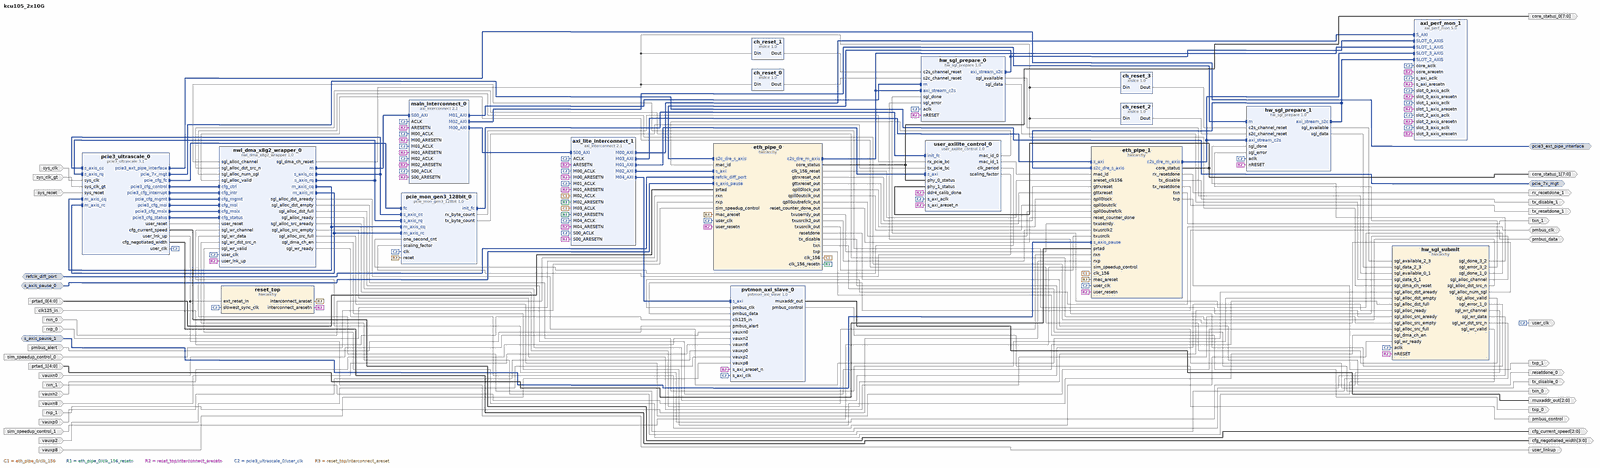
[diagram p0: block diagram of the top level, whole]
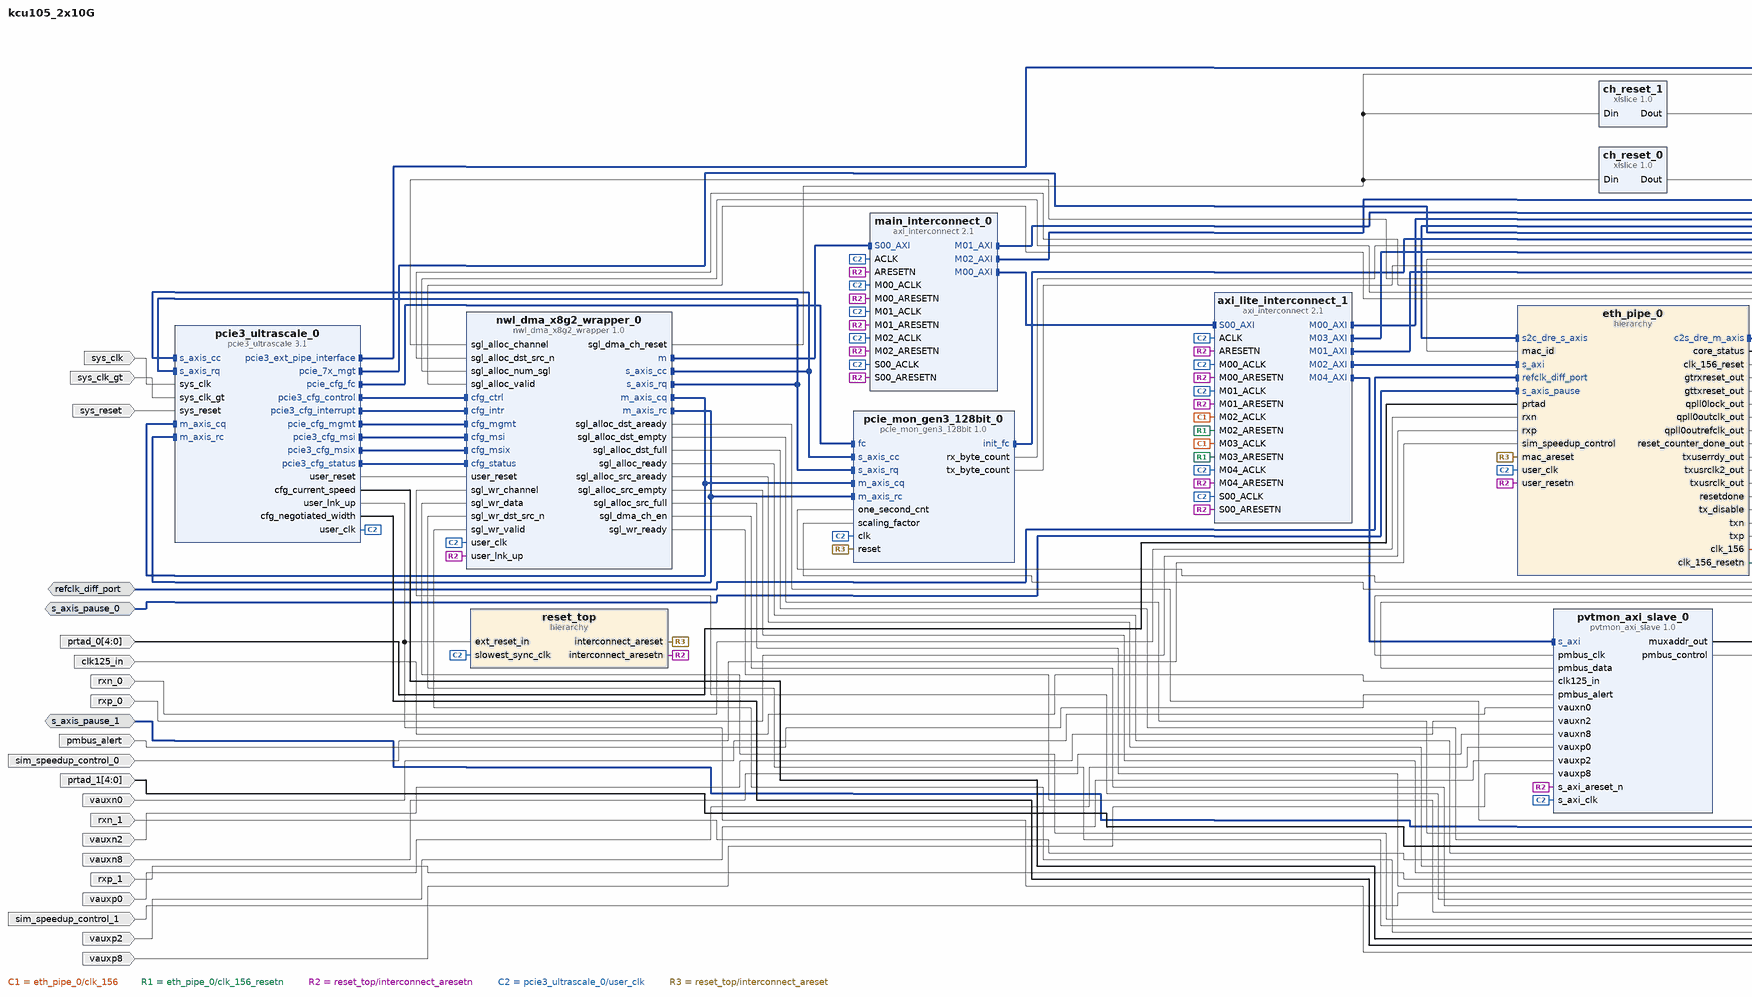
[diagram p1: block diagram of the top level, left part]
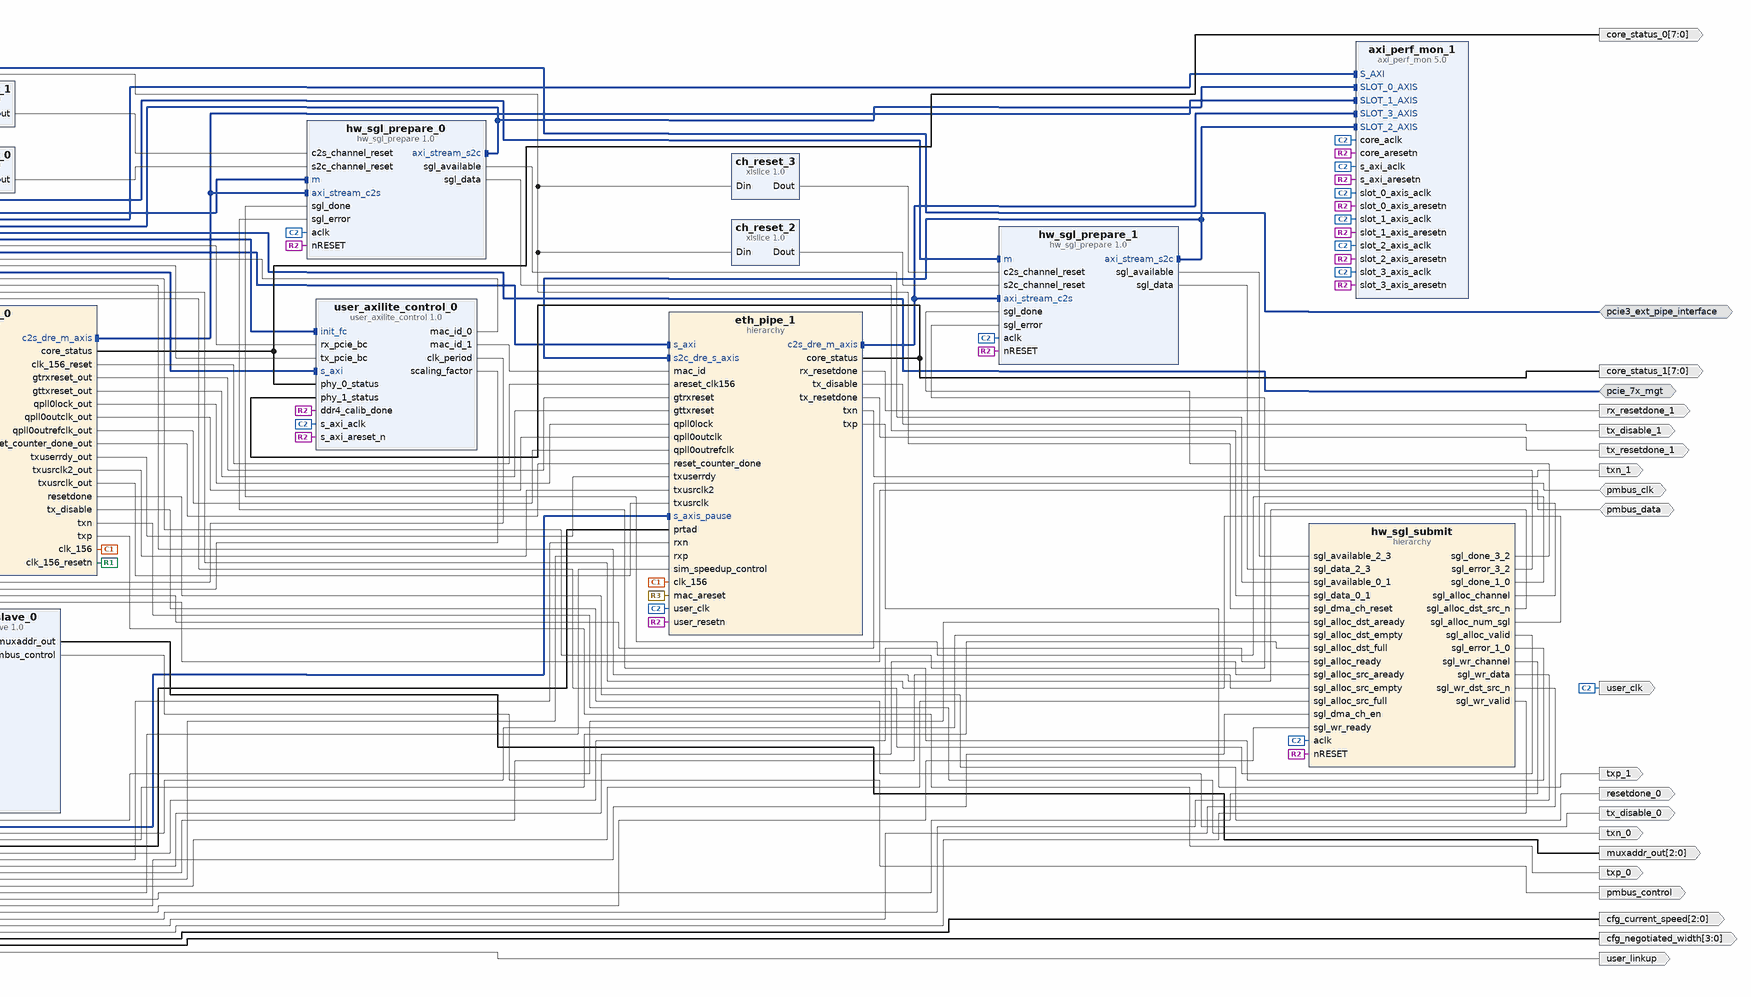
[diagram p2: block diagram of the top level, right part]
# Vivado block design kcu105_2x10G, Vivado 2014.3
create_bd_design kcu105_2x10G

create_bd_intf_port -mode Master -vlnv xilinx.com:display_pcie3_ultrascale:ext_pipe_rtl:1.0 pcie3_ext_pipe_interface
create_bd_intf_port -mode Master -vlnv xilinx.com:interface:pcie_7x_mgt_rtl:1.0 pcie_7x_mgt
create_bd_intf_port -mode Slave -vlnv xilinx.com:interface:diff_clock_rtl:1.0 refclk_diff_port
set_property -dict {CONFIG.FREQ_HZ 156250000} [get_bd_intf_ports refclk_diff_port]
create_bd_intf_port -mode Slave -vlnv xilinx.com:interface:axis_rtl:1.0 s_axis_pause_0
set_property -dict [list \
  CONFIG.TDATA_NUM_BYTES 2 \
  CONFIG.TDEST_WIDTH 0 \
  CONFIG.TID_WIDTH 0 \
  CONFIG.TUSER_WIDTH 0 \
  CONFIG.HAS_TREADY 0 \
  CONFIG.HAS_TSTRB 0 \
  CONFIG.HAS_TKEEP 0 \
  CONFIG.HAS_TLAST 0 \
  CONFIG.FREQ_HZ 156250000 \
  CONFIG.PHASE 0.000 \
  CONFIG.LAYERED_METADATA undef \
] [get_bd_intf_ports s_axis_pause_0]
create_bd_intf_port -mode Slave -vlnv xilinx.com:interface:axis_rtl:1.0 s_axis_pause_1
set_property -dict [list \
  CONFIG.TDATA_NUM_BYTES 2 \
  CONFIG.TDEST_WIDTH 0 \
  CONFIG.TID_WIDTH 0 \
  CONFIG.TUSER_WIDTH 0 \
  CONFIG.HAS_TREADY 0 \
  CONFIG.HAS_TSTRB 0 \
  CONFIG.HAS_TKEEP 0 \
  CONFIG.HAS_TLAST 0 \
  CONFIG.FREQ_HZ 156250000 \
  CONFIG.PHASE 0.000 \
  CONFIG.LAYERED_METADATA undef \
] [get_bd_intf_ports s_axis_pause_1]
create_bd_port -dir IO pmbus_clk
create_bd_port -dir IO pmbus_data
create_bd_port -dir I clk125_in
create_bd_port -dir O -from 7 -to 0 core_status_0
create_bd_port -dir O resetdone_0
create_bd_port -dir O tx_disable_0
create_bd_port -dir O txn_0
create_bd_port -dir O txp_0
create_bd_port -dir O -from 7 -to 0 core_status_1
create_bd_port -dir O rx_resetdone_1
create_bd_port -dir O tx_disable_1
create_bd_port -dir O tx_resetdone_1
create_bd_port -dir O txn_1
create_bd_port -dir O txp_1
create_bd_port -dir O -from 2 -to 0 cfg_current_speed
create_bd_port -dir O -from 3 -to 0 cfg_negotiated_width
create_bd_port -dir O user_clk
create_bd_port -dir I pmbus_alert
create_bd_port -dir I -from 4 -to 0 prtad_0
create_bd_port -dir I -from 4 -to 0 prtad_1
create_bd_port -dir O -from 2 -to 0 muxaddr_out
create_bd_port -dir O pmbus_control
create_bd_port -dir I rxn_0
create_bd_port -dir I rxn_1
create_bd_port -dir I rxp_0
create_bd_port -dir I rxp_1
create_bd_port -dir I sim_speedup_control_0
create_bd_port -dir I sim_speedup_control_1
create_bd_port -dir I -type clk sys_clk
create_bd_port -dir I -type clk sys_clk_gt
create_bd_port -dir I -type rst sys_reset
set_property -dict {CONFIG.POLARITY ACTIVE_LOW} [get_bd_ports sys_reset]
create_bd_port -dir O user_linkup
create_bd_port -dir I vauxn0
create_bd_port -dir I vauxn2
create_bd_port -dir I vauxn8
create_bd_port -dir I vauxp0
create_bd_port -dir I vauxp2
create_bd_port -dir I vauxp8

create_bd_cell -type ip -vlnv xilinx.com:ip:axi_interconnect:2.1 axi_lite_interconnect_1
set_property -dict [list \
  CONFIG.NUM_MI 5 \
  CONFIG.M00_HAS_REGSLICE 1 \
  CONFIG.M01_HAS_REGSLICE 1 \
  CONFIG.M02_HAS_REGSLICE 1 \
  CONFIG.M03_HAS_REGSLICE 1 \
  CONFIG.M04_HAS_REGSLICE 1 \
  CONFIG.S00_HAS_REGSLICE 3 \
] [get_bd_cells axi_lite_interconnect_1]
create_bd_cell -type ip -vlnv xilinx.com:ip:axi_perf_mon:5.0 axi_perf_mon_1
set_property -dict [list \
  CONFIG.C_SLOT_3_AXI_PROTOCOL AXI4S \
  CONFIG.C_SLOT_2_AXI_PROTOCOL AXI4S \
  CONFIG.C_SLOT_1_AXI_PROTOCOL AXI4S \
  CONFIG.C_SLOT_0_AXI_PROTOCOL AXI4S \
  CONFIG.C_NUM_OF_COUNTERS 4 \
  CONFIG.C_NUM_MONITOR_SLOTS 4 \
] [get_bd_cells axi_perf_mon_1]
create_bd_cell -type ip -vlnv xilinx.com:ip:xlslice:1.0 ch_reset_0
set_property -dict {CONFIG.DIN_WIDTH 4} [get_bd_cells ch_reset_0]
create_bd_cell -type ip -vlnv xilinx.com:ip:xlslice:1.0 ch_reset_1
set_property -dict {CONFIG.DIN_TO 1 CONFIG.DIN_FROM 1 CONFIG.DIN_WIDTH 4} [get_bd_cells ch_reset_1]
create_bd_cell -type ip -vlnv xilinx.com:ip:xlslice:1.0 ch_reset_2
set_property -dict {CONFIG.DIN_TO 2 CONFIG.DIN_FROM 2 CONFIG.DIN_WIDTH 4} [get_bd_cells ch_reset_2]
create_bd_cell -type ip -vlnv xilinx.com:ip:xlslice:1.0 ch_reset_3
set_property -dict {CONFIG.DIN_TO 3 CONFIG.DIN_FROM 3 CONFIG.DIN_WIDTH 4} [get_bd_cells ch_reset_3]
create_bd_cell -type hier eth_pipe_0
create_bd_cell -type hier eth_pipe_1
create_bd_cell -type hier hw_sgl_submit
create_bd_cell -type ip -vlnv xilinx.com:ip:axi_interconnect:2.1 main_interconnect_0
set_property -dict [list \
  CONFIG.NUM_MI 3 \
  CONFIG.STRATEGY 2 \
  CONFIG.ENABLE_ADVANCED_OPTIONS 1 \
  CONFIG.ENABLE_PROTOCOL_CHECKERS 0 \
  CONFIG.M00_HAS_REGSLICE 1 \
  CONFIG.M01_HAS_DATA_FIFO 1 \
  CONFIG.M02_HAS_DATA_FIFO 1 \
  CONFIG.S00_HAS_REGSLICE 3 \
] [get_bd_cells main_interconnect_0]
create_bd_cell -type ip -vlnv xilinx.com:user:nwl_dma_x8g2_wrapper:1.0 nwl_dma_x8g2_wrapper_0
create_bd_cell -type ip -vlnv xilinx.com:ip:pcie3_ultrascale:3.1 pcie3_ultrascale_0
set_property -dict [list \
  CONFIG.PL_LINK_CAP_MAX_LINK_SPEED 5.0_GT/s \
  CONFIG.PL_LINK_CAP_MAX_LINK_WIDTH X8 \
  CONFIG.PF0_DEVICE_ID 8082 \
  CONFIG.PF0_MSIX_CAP_PBA_BIR BAR_1:0 \
  CONFIG.PF0_MSIX_CAP_PBA_OFFSET 00003000 \
  CONFIG.PF0_MSIX_CAP_TABLE_BIR BAR_1:0 \
  CONFIG.PF0_MSIX_CAP_TABLE_OFFSET 00002000 \
  CONFIG.PF0_MSIX_CAP_TABLE_SIZE 003 \
  CONFIG.PF1_DEVICE_ID 8011 \
  CONFIG.pf0_bar0_64bit true \
  CONFIG.pf0_bar0_scale Megabytes \
  CONFIG.pf0_bar0_size 1 \
  CONFIG.pf0_bar2_enabled true \
  CONFIG.pf0_bar2_type Memory \
  CONFIG.pf0_bar2_64bit true \
  CONFIG.pf0_bar2_scale Megabytes \
  CONFIG.pf0_bar2_size 1 \
  CONFIG.pf0_bar4_enabled true \
  CONFIG.pf0_bar4_type Memory \
  CONFIG.pf0_bar4_64bit true \
  CONFIG.pf0_bar4_scale Megabytes \
  CONFIG.pf0_bar4_size 1 \
  CONFIG.axisten_if_width 128_bit \
  CONFIG.pf0_msix_enabled true \
  CONFIG.mode_selection Advanced \
  CONFIG.pipe_sim true \
  CONFIG.axisten_freq 250 \
  CONFIG.cfg_ext_if false \
  CONFIG.per_func_status_if false \
  CONFIG.rcv_msg_if false \
  CONFIG.cfg_tx_msg_if false \
  CONFIG.tx_fc_if false \
  CONFIG.dedicate_perst false \
] [get_bd_cells pcie3_ultrascale_0]
create_bd_cell -type ip -vlnv xilinx.com:ip:pcie_mon_gen3_128bit:1.0 pcie_mon_gen3_128bit_0
create_bd_cell -type ip -vlnv xilinx.com:user:pvtmon_axi_slave:1.0 pvtmon_axi_slave_0
create_bd_cell -type hier reset_top
create_bd_cell -type ip -vlnv xilinx.com:user:user_axilite_control:1.0 user_axilite_control_0
create_bd_cell -type ip -vlnv xilinx.com:ip:hw_sgl_prepare:1.0 hw_sgl_prepare_0
set_property -dict {CONFIG.START_ADDRESS 0x44000000} [get_bd_cells hw_sgl_prepare_0]
create_bd_cell -type ip -vlnv xilinx.com:ip:hw_sgl_prepare:1.0 hw_sgl_prepare_1
set_property -dict {CONFIG.START_ADDRESS 0x45000000} [get_bd_cells hw_sgl_prepare_1]

# ---- hierarchy /eth_pipe_0 ----
current_bd_instance /eth_pipe_0
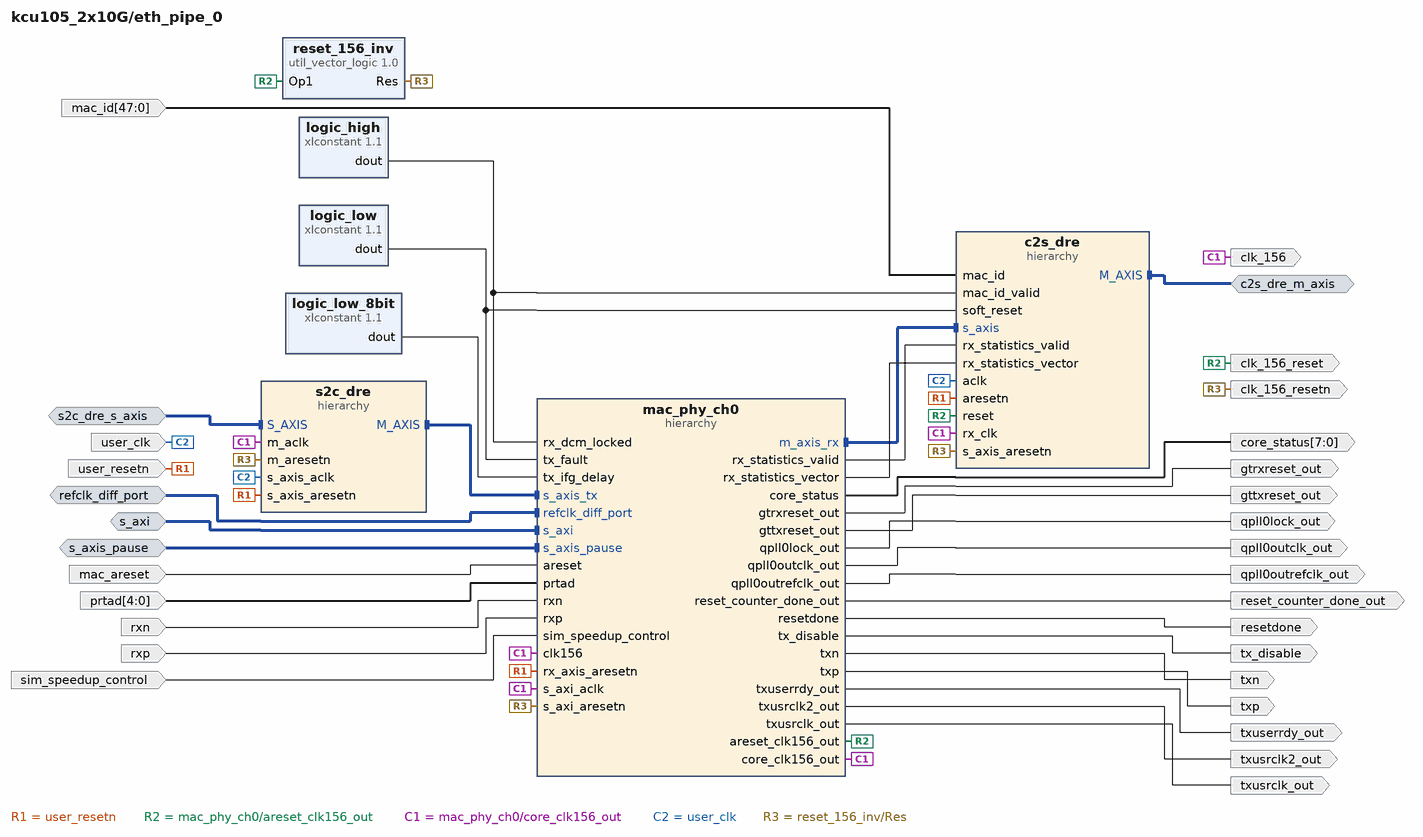
[diagram p3: block diagram inside /eth_pipe_0]
create_bd_intf_pin -mode Master -vlnv xilinx.com:interface:axis_rtl:1.0 c2s_dre_m_axis
create_bd_intf_pin -mode Slave -vlnv xilinx.com:interface:diff_clock_rtl:1.0 refclk_diff_port
create_bd_intf_pin -mode Slave -vlnv xilinx.com:interface:axis_rtl:1.0 s2c_dre_s_axis
create_bd_intf_pin -mode Slave -vlnv xilinx.com:interface:aximm_rtl:1.0 s_axi
create_bd_intf_pin -mode Slave -vlnv xilinx.com:interface:axis_rtl:1.0 s_axis_pause
create_bd_pin -dir O clk_156
create_bd_pin -dir O clk_156_reset
create_bd_pin -dir O clk_156_resetn
create_bd_pin -dir O -from 7 -to 0 core_status
create_bd_pin -dir O gtrxreset_out
create_bd_pin -dir O gttxreset_out
create_bd_pin -dir I mac_areset
create_bd_pin -dir I -from 47 -to 0 mac_id
create_bd_pin -dir I -from 4 -to 0 prtad
create_bd_pin -dir O qpll0lock_out
create_bd_pin -dir O qpll0outclk_out
create_bd_pin -dir O qpll0outrefclk_out
create_bd_pin -dir O reset_counter_done_out
create_bd_pin -dir O resetdone
create_bd_pin -dir I rxn
create_bd_pin -dir I rxp
create_bd_pin -dir I sim_speedup_control
create_bd_pin -dir O tx_disable
create_bd_pin -dir O txn
create_bd_pin -dir O txp
create_bd_pin -dir O txuserrdy_out
create_bd_pin -dir O txusrclk2_out
create_bd_pin -dir O txusrclk_out
create_bd_pin -dir I user_clk
create_bd_pin -dir I user_resetn

create_bd_cell -type hier c2s_dre
create_bd_cell -type ip -vlnv xilinx.com:ip:xlconstant:1.1 logic_high
create_bd_cell -type ip -vlnv xilinx.com:ip:xlconstant:1.1 logic_low
create_bd_cell -type ip -vlnv xilinx.com:ip:xlconstant:1.1 logic_low_8bit
set_property -dict {CONFIG.CONST_WIDTH 8 CONFIG.CONST_VAL 0} [get_bd_cells logic_low_8bit]
create_bd_cell -type hier mac_phy_ch0
create_bd_cell -type ip -vlnv xilinx.com:ip:util_vector_logic:1.0 reset_156_inv
set_property -dict {CONFIG.C_SIZE 1 CONFIG.C_OPERATION not} [get_bd_cells reset_156_inv]
create_bd_cell -type hier s2c_dre

# ---- hierarchy /eth_pipe_0/c2s_dre ----
current_bd_instance /eth_pipe_0/c2s_dre
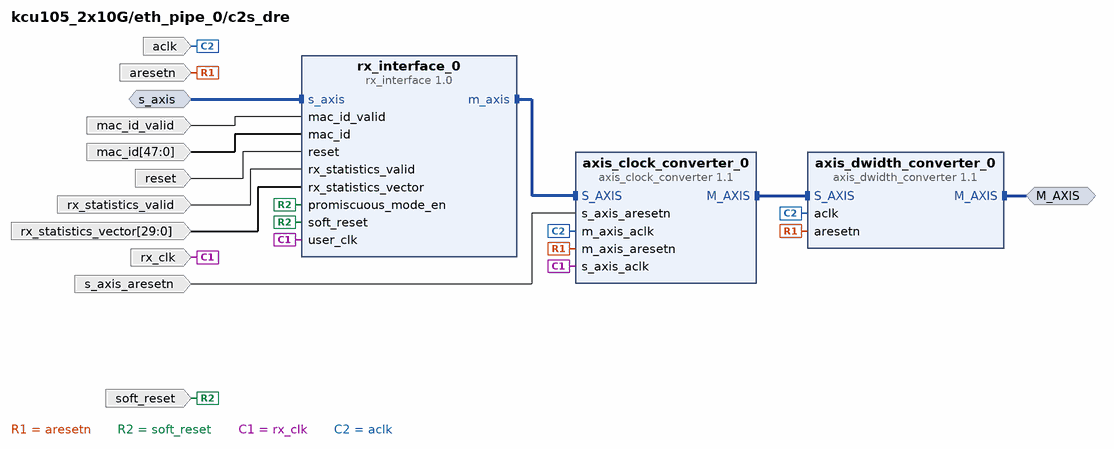
[diagram p4: block diagram inside /eth_pipe_0/c2s_dre]
create_bd_intf_pin -mode Master -vlnv xilinx.com:interface:axis_rtl:1.0 M_AXIS
create_bd_intf_pin -mode Slave -vlnv xilinx.com:interface:axis_rtl:1.0 s_axis
create_bd_pin -dir I -type clk aclk
create_bd_pin -dir I -type rst aresetn
create_bd_pin -dir I -from 47 -to 0 mac_id
create_bd_pin -dir I mac_id_valid
create_bd_pin -dir I reset
create_bd_pin -dir I -type clk rx_clk
create_bd_pin -dir I rx_statistics_valid
create_bd_pin -dir I -from 29 -to 0 rx_statistics_vector
create_bd_pin -dir I -type rst s_axis_aresetn
create_bd_pin -dir I soft_reset

create_bd_cell -type ip -vlnv xilinx.com:ip:axis_clock_converter:1.1 axis_clock_converter_0
set_property -dict [list \
  CONFIG.TDATA_NUM_BYTES 8 \
  CONFIG.TDEST_WIDTH 2 \
  CONFIG.HAS_TKEEP 1 \
  CONFIG.HAS_TLAST 1 \
] [get_bd_cells axis_clock_converter_0]
create_bd_cell -type ip -vlnv xilinx.com:ip:axis_dwidth_converter:1.1 axis_dwidth_converter_0
set_property -dict {CONFIG.M_TDATA_NUM_BYTES 16} [get_bd_cells axis_dwidth_converter_0]
create_bd_cell -type ip -vlnv xilinx.com:user:rx_interface:1.0 rx_interface_0
set_property -dict {CONFIG.FIFO_CNT_WIDTH 13} [get_bd_cells rx_interface_0]

# ---- hierarchy /eth_pipe_0/mac_phy_ch0 ----
current_bd_instance /eth_pipe_0/mac_phy_ch0
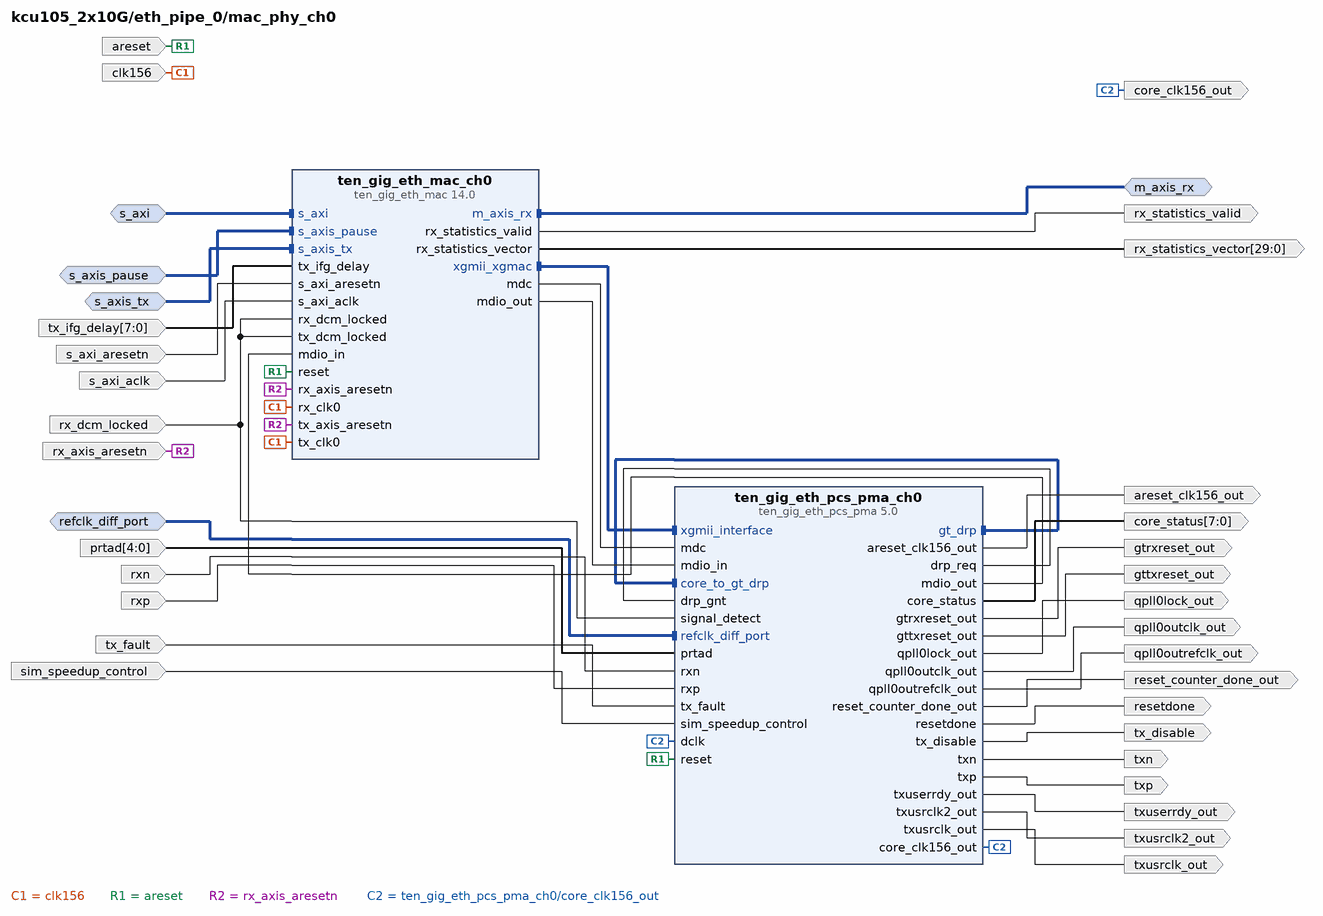
[diagram p5: block diagram inside /eth_pipe_0/mac_phy_ch0]
create_bd_intf_pin -mode Master -vlnv xilinx.com:interface:axis_rtl:1.0 m_axis_rx
create_bd_intf_pin -mode Slave -vlnv xilinx.com:interface:diff_clock_rtl:1.0 refclk_diff_port
create_bd_intf_pin -mode Slave -vlnv xilinx.com:interface:aximm_rtl:1.0 s_axi
create_bd_intf_pin -mode Slave -vlnv xilinx.com:interface:axis_rtl:1.0 s_axis_pause
create_bd_intf_pin -mode Slave -vlnv xilinx.com:interface:axis_rtl:1.0 s_axis_tx
create_bd_pin -dir I areset
create_bd_pin -dir O -type rst areset_clk156_out
create_bd_pin -dir I -type clk clk156
create_bd_pin -dir O -type clk core_clk156_out
create_bd_pin -dir O -from 7 -to 0 core_status
create_bd_pin -dir O -type rst gtrxreset_out
create_bd_pin -dir O -type rst gttxreset_out
create_bd_pin -dir I -from 4 -to 0 prtad
create_bd_pin -dir O qpll0lock_out
create_bd_pin -dir O -type clk qpll0outclk_out
create_bd_pin -dir O -type clk qpll0outrefclk_out
create_bd_pin -dir O reset_counter_done_out
create_bd_pin -dir O resetdone
create_bd_pin -dir I -type rst rx_axis_aresetn
create_bd_pin -dir I rx_dcm_locked
create_bd_pin -dir O rx_statistics_valid
create_bd_pin -dir O -from 29 -to 0 rx_statistics_vector
create_bd_pin -dir I rxn
create_bd_pin -dir I rxp
create_bd_pin -dir I s_axi_aclk
create_bd_pin -dir I s_axi_aresetn
create_bd_pin -dir I sim_speedup_control
create_bd_pin -dir O tx_disable
create_bd_pin -dir I tx_fault
create_bd_pin -dir I -from 7 -to 0 tx_ifg_delay
create_bd_pin -dir O txn
create_bd_pin -dir O txp
create_bd_pin -dir O txuserrdy_out
create_bd_pin -dir O -type clk txusrclk2_out
create_bd_pin -dir O -type clk txusrclk_out

create_bd_cell -type ip -vlnv xilinx.com:ip:ten_gig_eth_mac:14.0 ten_gig_eth_mac_ch0
create_bd_cell -type ip -vlnv xilinx.com:ip:ten_gig_eth_pcs_pma:5.0 ten_gig_eth_pcs_pma_ch0
set_property -dict {CONFIG.base_kr BASE-R CONFIG.SupportLevel 1 CONFIG.Locations X0Y10} [get_bd_cells ten_gig_eth_pcs_pma_ch0]

# ---- hierarchy /eth_pipe_0/s2c_dre ----
current_bd_instance /eth_pipe_0/s2c_dre
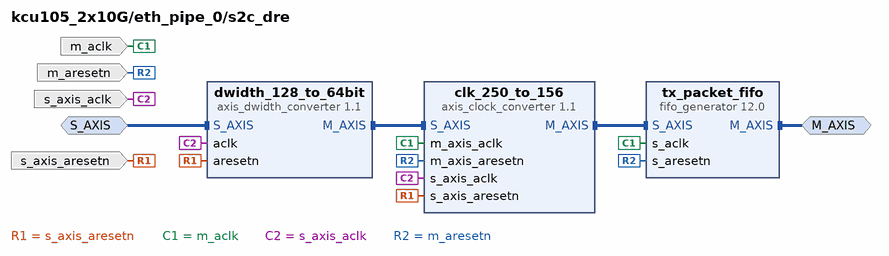
[diagram p6: block diagram inside /eth_pipe_0/s2c_dre]
create_bd_intf_pin -mode Master -vlnv xilinx.com:interface:axis_rtl:1.0 M_AXIS
create_bd_intf_pin -mode Slave -vlnv xilinx.com:interface:axis_rtl:1.0 S_AXIS
create_bd_pin -dir I -type clk m_aclk
create_bd_pin -dir I -type rst m_aresetn
create_bd_pin -dir I -type clk s_axis_aclk
create_bd_pin -dir I -type rst s_axis_aresetn

create_bd_cell -type ip -vlnv xilinx.com:ip:axis_clock_converter:1.1 clk_250_to_156
set_property -dict {CONFIG.TDATA_NUM_BYTES 8 CONFIG.HAS_TKEEP 1 CONFIG.HAS_TLAST 1} [get_bd_cells clk_250_to_156]
create_bd_cell -type ip -vlnv xilinx.com:ip:axis_dwidth_converter:1.1 dwidth_128_to_64bit
set_property -dict {CONFIG.M_TDATA_NUM_BYTES 8} [get_bd_cells dwidth_128_to_64bit]
create_bd_cell -type ip -vlnv xilinx.com:ip:fifo_generator:12.0 tx_packet_fifo
set_property -dict [list \
  CONFIG.INTERFACE_TYPE AXI_STREAM \
  CONFIG.Clock_Type_AXI Common_Clock \
  CONFIG.TDATA_NUM_BYTES 8 \
  CONFIG.TUSER_WIDTH 0 \
  CONFIG.Enable_TLAST true \
  CONFIG.HAS_TKEEP true \
  CONFIG.FIFO_Implementation_wach Common_Clock_Distributed_RAM \
  CONFIG.FIFO_Implementation_wdch Common_Clock_Builtin_FIFO \
  CONFIG.Input_Depth_wdch 512 \
  CONFIG.FIFO_Implementation_wrch Common_Clock_Distributed_RAM \
  CONFIG.FIFO_Implementation_rach Common_Clock_Distributed_RAM \
  CONFIG.FIFO_Implementation_rdch Common_Clock_Builtin_FIFO \
  CONFIG.Input_Depth_rdch 512 \
  CONFIG.FIFO_Implementation_axis Common_Clock_Block_RAM \
  CONFIG.FIFO_Application_Type_axis Packet_FIFO \
  CONFIG.Input_Depth_axis 2048 \
] [get_bd_cells tx_packet_fifo]

# ---- hierarchy /eth_pipe_1 ----
current_bd_instance /eth_pipe_1
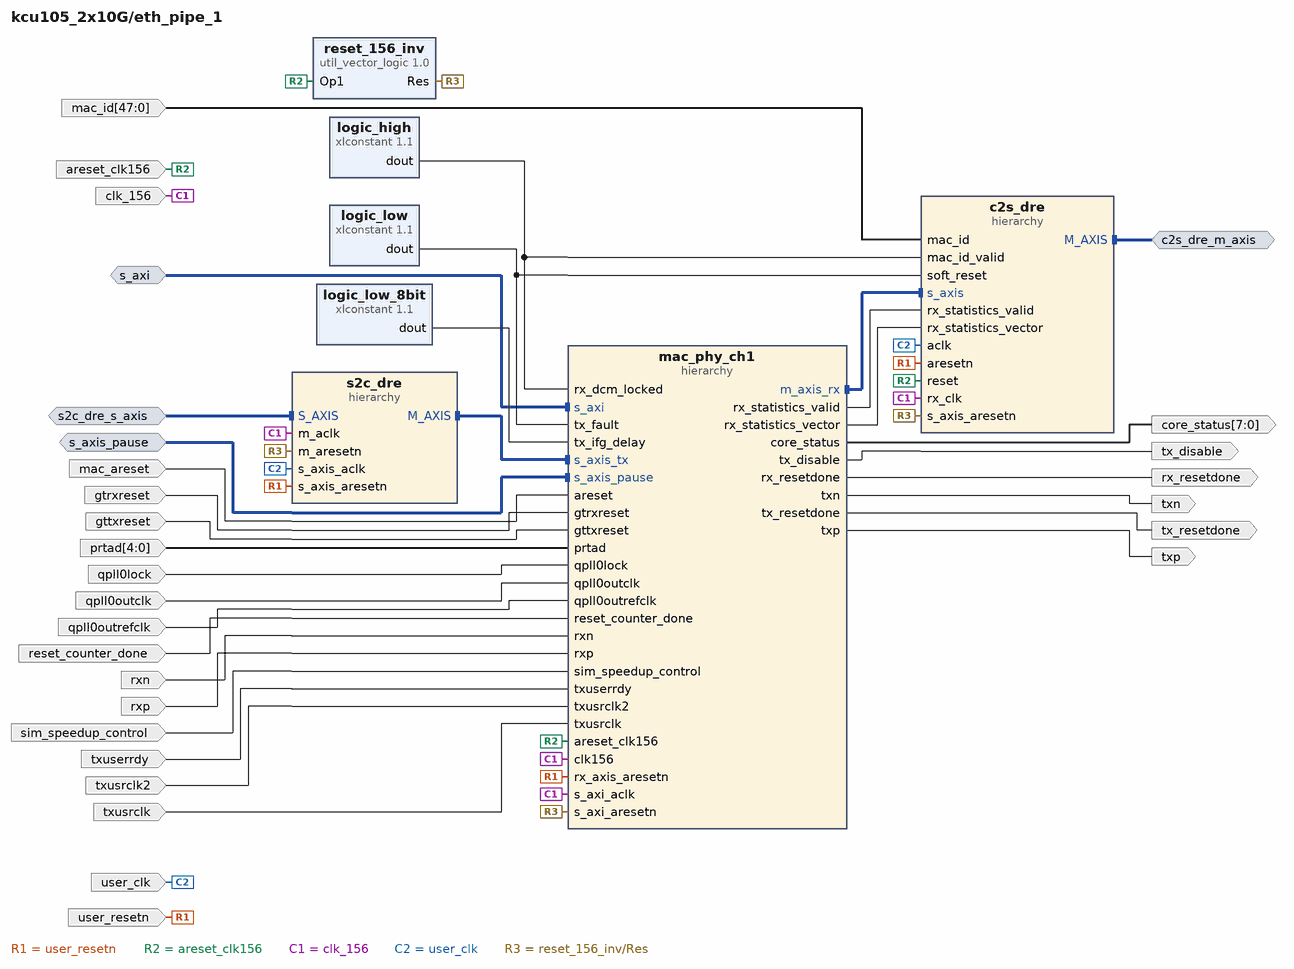
[diagram p7: block diagram inside /eth_pipe_1]
create_bd_intf_pin -mode Master -vlnv xilinx.com:interface:axis_rtl:1.0 c2s_dre_m_axis
create_bd_intf_pin -mode Slave -vlnv xilinx.com:interface:axis_rtl:1.0 s2c_dre_s_axis
create_bd_intf_pin -mode Slave -vlnv xilinx.com:interface:aximm_rtl:1.0 s_axi
create_bd_intf_pin -mode Slave -vlnv xilinx.com:interface:axis_rtl:1.0 s_axis_pause
create_bd_pin -dir I areset_clk156
create_bd_pin -dir I clk_156
create_bd_pin -dir O -from 7 -to 0 core_status
create_bd_pin -dir I gtrxreset
create_bd_pin -dir I gttxreset
create_bd_pin -dir I mac_areset
create_bd_pin -dir I -from 47 -to 0 mac_id
create_bd_pin -dir I -from 4 -to 0 prtad
create_bd_pin -dir I qpll0lock
create_bd_pin -dir I qpll0outclk
create_bd_pin -dir I qpll0outrefclk
create_bd_pin -dir I reset_counter_done
create_bd_pin -dir O rx_resetdone
create_bd_pin -dir I rxn
create_bd_pin -dir I rxp
create_bd_pin -dir I sim_speedup_control
create_bd_pin -dir O tx_disable
create_bd_pin -dir O tx_resetdone
create_bd_pin -dir O txn
create_bd_pin -dir O txp
create_bd_pin -dir I txuserrdy
create_bd_pin -dir I txusrclk
create_bd_pin -dir I txusrclk2
create_bd_pin -dir I user_clk
create_bd_pin -dir I user_resetn

create_bd_cell -type hier c2s_dre
create_bd_cell -type ip -vlnv xilinx.com:ip:xlconstant:1.1 logic_high
create_bd_cell -type ip -vlnv xilinx.com:ip:xlconstant:1.1 logic_low
create_bd_cell -type ip -vlnv xilinx.com:ip:xlconstant:1.1 logic_low_8bit
set_property -dict {CONFIG.CONST_WIDTH 8 CONFIG.CONST_VAL 0} [get_bd_cells logic_low_8bit]
create_bd_cell -type hier mac_phy_ch1
create_bd_cell -type ip -vlnv xilinx.com:ip:util_vector_logic:1.0 reset_156_inv
set_property -dict {CONFIG.C_SIZE 1 CONFIG.C_OPERATION not} [get_bd_cells reset_156_inv]
create_bd_cell -type hier s2c_dre

# ---- hierarchy /eth_pipe_1/c2s_dre ----
current_bd_instance /eth_pipe_1/c2s_dre
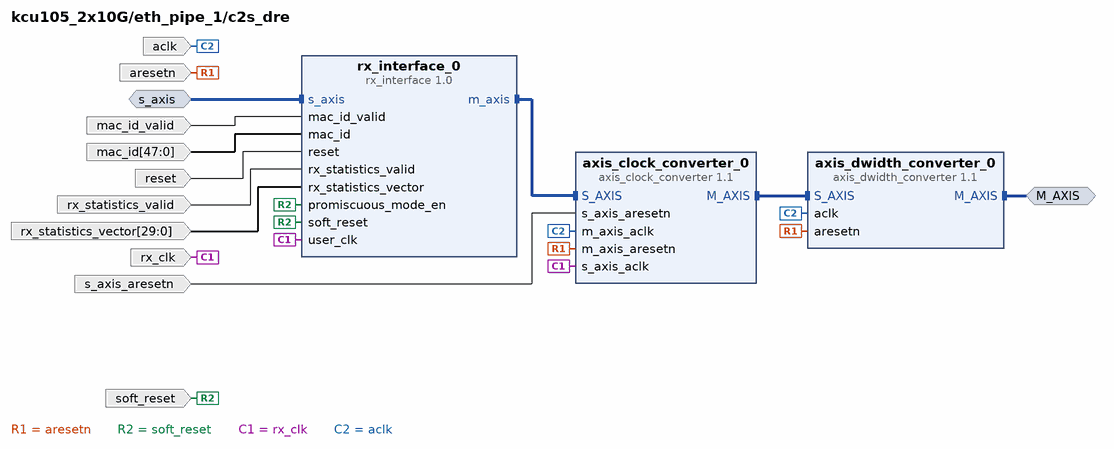
[diagram p8: block diagram inside /eth_pipe_1/c2s_dre]
create_bd_intf_pin -mode Master -vlnv xilinx.com:interface:axis_rtl:1.0 M_AXIS
create_bd_intf_pin -mode Slave -vlnv xilinx.com:interface:axis_rtl:1.0 s_axis
create_bd_pin -dir I -type clk aclk
create_bd_pin -dir I -type rst aresetn
create_bd_pin -dir I -from 47 -to 0 mac_id
create_bd_pin -dir I mac_id_valid
create_bd_pin -dir I reset
create_bd_pin -dir I -type clk rx_clk
create_bd_pin -dir I rx_statistics_valid
create_bd_pin -dir I -from 29 -to 0 rx_statistics_vector
create_bd_pin -dir I -type rst s_axis_aresetn
create_bd_pin -dir I soft_reset

create_bd_cell -type ip -vlnv xilinx.com:ip:axis_clock_converter:1.1 axis_clock_converter_0
set_property -dict [list \
  CONFIG.TDATA_NUM_BYTES 8 \
  CONFIG.TDEST_WIDTH 2 \
  CONFIG.HAS_TKEEP 1 \
  CONFIG.HAS_TLAST 1 \
] [get_bd_cells axis_clock_converter_0]
create_bd_cell -type ip -vlnv xilinx.com:ip:axis_dwidth_converter:1.1 axis_dwidth_converter_0
set_property -dict {CONFIG.M_TDATA_NUM_BYTES 16} [get_bd_cells axis_dwidth_converter_0]
create_bd_cell -type ip -vlnv xilinx.com:user:rx_interface:1.0 rx_interface_0
set_property -dict {CONFIG.FIFO_CNT_WIDTH 13} [get_bd_cells rx_interface_0]

# ---- hierarchy /eth_pipe_1/mac_phy_ch1 ----
current_bd_instance /eth_pipe_1/mac_phy_ch1
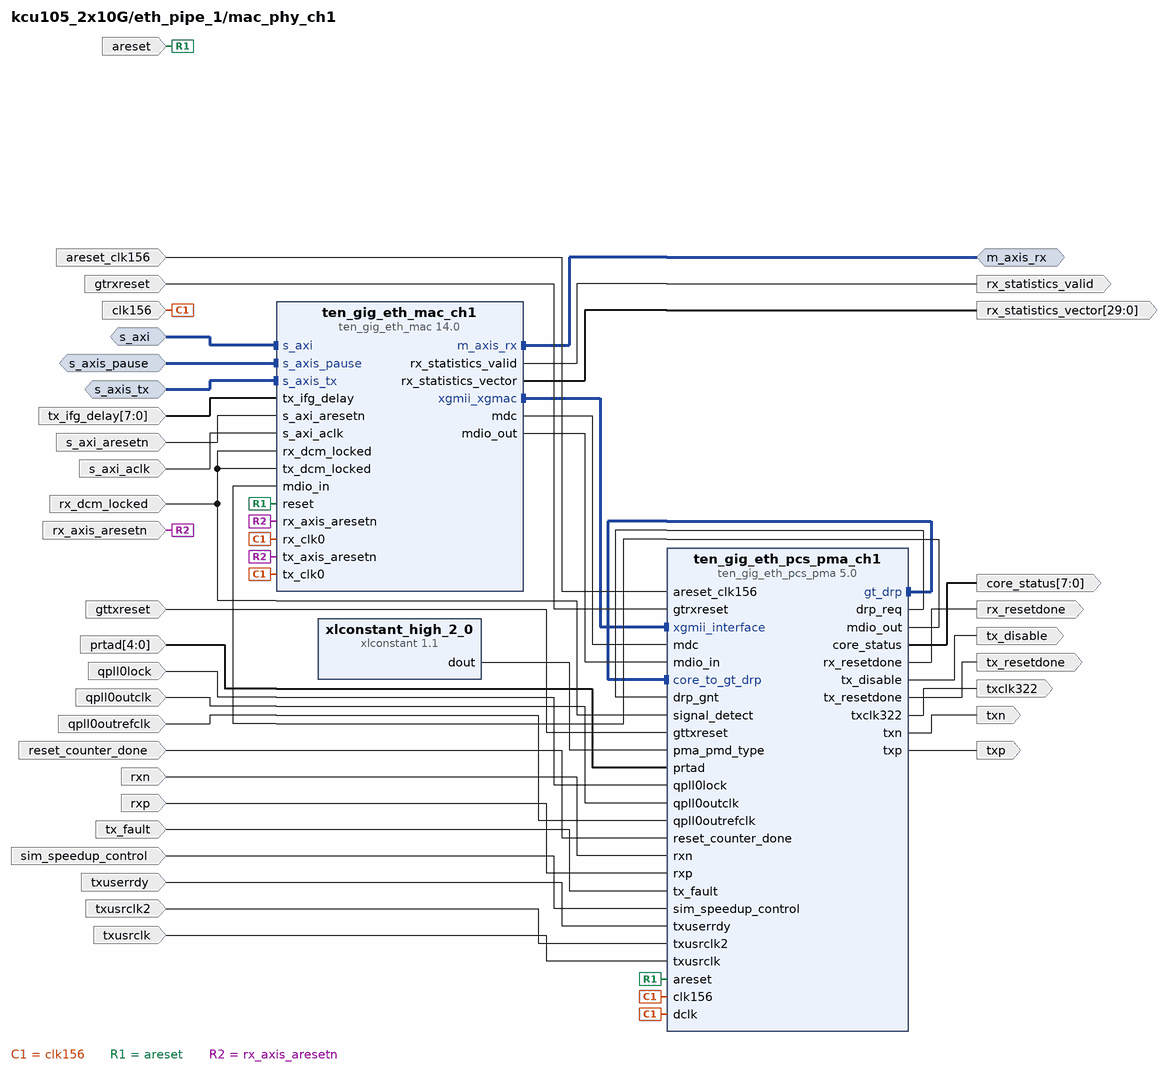
[diagram p9: block diagram inside /eth_pipe_1/mac_phy_ch1]
create_bd_intf_pin -mode Master -vlnv xilinx.com:interface:axis_rtl:1.0 m_axis_rx
create_bd_intf_pin -mode Slave -vlnv xilinx.com:interface:aximm_rtl:1.0 s_axi
create_bd_intf_pin -mode Slave -vlnv xilinx.com:interface:axis_rtl:1.0 s_axis_pause
create_bd_intf_pin -mode Slave -vlnv xilinx.com:interface:axis_rtl:1.0 s_axis_tx
create_bd_pin -dir I areset
create_bd_pin -dir I areset_clk156
create_bd_pin -dir I -type clk clk156
create_bd_pin -dir O -from 7 -to 0 core_status
create_bd_pin -dir I gtrxreset
create_bd_pin -dir I gttxreset
create_bd_pin -dir I -from 4 -to 0 prtad
create_bd_pin -dir I qpll0lock
create_bd_pin -dir I qpll0outclk
create_bd_pin -dir I qpll0outrefclk
create_bd_pin -dir I reset_counter_done
create_bd_pin -dir I -type rst rx_axis_aresetn
create_bd_pin -dir I rx_dcm_locked
create_bd_pin -dir O rx_resetdone
create_bd_pin -dir O rx_statistics_valid
create_bd_pin -dir O -from 29 -to 0 rx_statistics_vector
create_bd_pin -dir I rxn
create_bd_pin -dir I rxp
create_bd_pin -dir I s_axi_aclk
create_bd_pin -dir I s_axi_aresetn
create_bd_pin -dir I sim_speedup_control
create_bd_pin -dir O tx_disable
create_bd_pin -dir I tx_fault
create_bd_pin -dir I -from 7 -to 0 tx_ifg_delay
create_bd_pin -dir O tx_resetdone
create_bd_pin -dir O txclk322
create_bd_pin -dir O txn
create_bd_pin -dir O txp
create_bd_pin -dir I txuserrdy
create_bd_pin -dir I txusrclk
create_bd_pin -dir I txusrclk2

create_bd_cell -type ip -vlnv xilinx.com:ip:ten_gig_eth_mac:14.0 ten_gig_eth_mac_ch1
create_bd_cell -type ip -vlnv xilinx.com:ip:ten_gig_eth_pcs_pma:5.0 ten_gig_eth_pcs_pma_ch1
set_property -dict {CONFIG.base_kr BASE-R CONFIG.SupportLevel 0 CONFIG.Locations X0Y9} [get_bd_cells ten_gig_eth_pcs_pma_ch1]
create_bd_cell -type ip -vlnv xilinx.com:ip:xlconstant:1.1 xlconstant_high_2_0
set_property -dict {CONFIG.CONST_WIDTH 3 CONFIG.CONST_VAL 101} [get_bd_cells xlconstant_high_2_0]

# ---- hierarchy /eth_pipe_1/s2c_dre ----
current_bd_instance /eth_pipe_1/s2c_dre
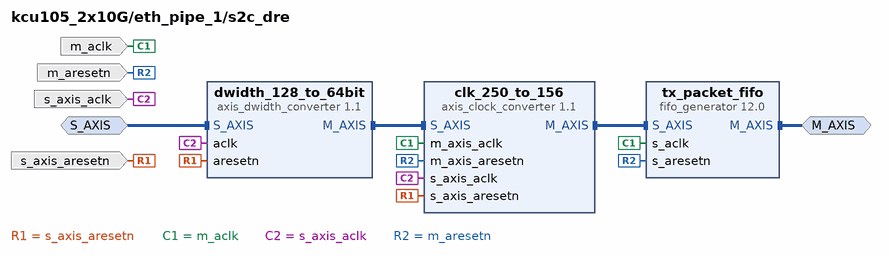
[diagram p10: block diagram inside /eth_pipe_1/s2c_dre]
create_bd_intf_pin -mode Master -vlnv xilinx.com:interface:axis_rtl:1.0 M_AXIS
create_bd_intf_pin -mode Slave -vlnv xilinx.com:interface:axis_rtl:1.0 S_AXIS
create_bd_pin -dir I -type clk m_aclk
create_bd_pin -dir I -type rst m_aresetn
create_bd_pin -dir I -type clk s_axis_aclk
create_bd_pin -dir I -type rst s_axis_aresetn

create_bd_cell -type ip -vlnv xilinx.com:ip:axis_clock_converter:1.1 clk_250_to_156
set_property -dict {CONFIG.TDATA_NUM_BYTES 8 CONFIG.HAS_TKEEP 1 CONFIG.HAS_TLAST 1} [get_bd_cells clk_250_to_156]
create_bd_cell -type ip -vlnv xilinx.com:ip:axis_dwidth_converter:1.1 dwidth_128_to_64bit
set_property -dict {CONFIG.M_TDATA_NUM_BYTES 8} [get_bd_cells dwidth_128_to_64bit]
create_bd_cell -type ip -vlnv xilinx.com:ip:fifo_generator:12.0 tx_packet_fifo
set_property -dict [list \
  CONFIG.INTERFACE_TYPE AXI_STREAM \
  CONFIG.Clock_Type_AXI Common_Clock \
  CONFIG.TDATA_NUM_BYTES 8 \
  CONFIG.TUSER_WIDTH 0 \
  CONFIG.Enable_TLAST true \
  CONFIG.HAS_TKEEP true \
  CONFIG.FIFO_Implementation_wach Common_Clock_Distributed_RAM \
  CONFIG.FIFO_Implementation_wdch Common_Clock_Builtin_FIFO \
  CONFIG.Input_Depth_wdch 512 \
  CONFIG.FIFO_Implementation_wrch Common_Clock_Distributed_RAM \
  CONFIG.FIFO_Implementation_rach Common_Clock_Distributed_RAM \
  CONFIG.FIFO_Implementation_rdch Common_Clock_Builtin_FIFO \
  CONFIG.Input_Depth_rdch 512 \
  CONFIG.FIFO_Implementation_axis Common_Clock_Block_RAM \
  CONFIG.FIFO_Application_Type_axis Packet_FIFO \
  CONFIG.Input_Depth_axis 2048 \
] [get_bd_cells tx_packet_fifo]

# ---- hierarchy /hw_sgl_submit ----
current_bd_instance /hw_sgl_submit
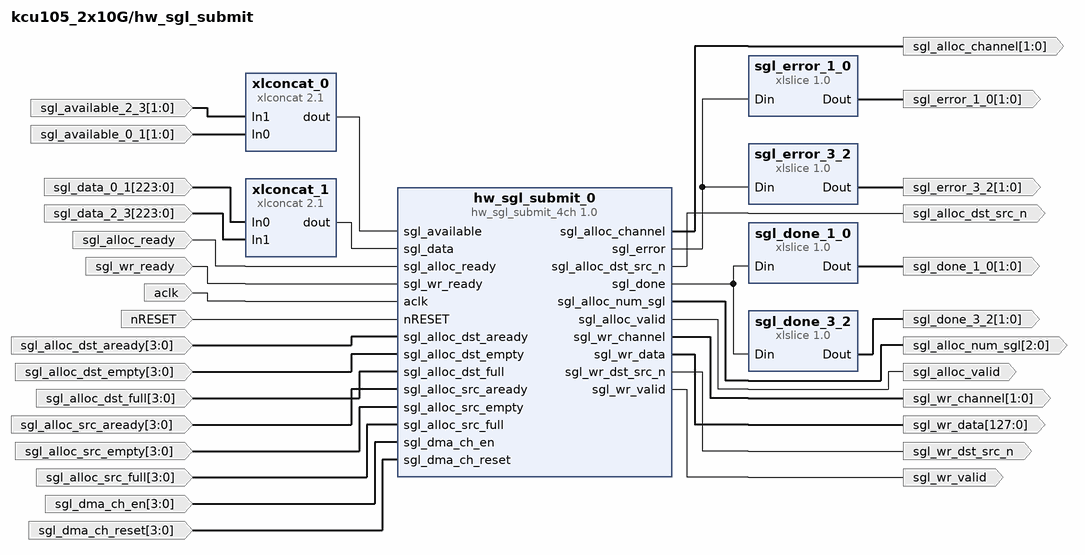
[diagram p11: block diagram inside /hw_sgl_submit]
create_bd_pin -dir I -type clk aclk
create_bd_pin -dir I -type rst nRESET
create_bd_pin -dir O -from 1 -to 0 sgl_alloc_channel
create_bd_pin -dir I -from 3 -to 0 sgl_alloc_dst_aready
create_bd_pin -dir I -from 3 -to 0 sgl_alloc_dst_empty
create_bd_pin -dir I -from 3 -to 0 sgl_alloc_dst_full
create_bd_pin -dir O sgl_alloc_dst_src_n
create_bd_pin -dir O -from 2 -to 0 sgl_alloc_num_sgl
create_bd_pin -dir I sgl_alloc_ready
create_bd_pin -dir I -from 3 -to 0 sgl_alloc_src_aready
create_bd_pin -dir I -from 3 -to 0 sgl_alloc_src_empty
create_bd_pin -dir I -from 3 -to 0 sgl_alloc_src_full
create_bd_pin -dir O sgl_alloc_valid
create_bd_pin -dir I -from 1 -to 0 sgl_available_0_1
create_bd_pin -dir I -from 1 -to 0 sgl_available_2_3
create_bd_pin -dir I -from 223 -to 0 sgl_data_0_1
create_bd_pin -dir I -from 223 -to 0 sgl_data_2_3
create_bd_pin -dir I -from 3 -to 0 sgl_dma_ch_en
create_bd_pin -dir I -from 3 -to 0 sgl_dma_ch_reset
create_bd_pin -dir O -from 1 -to 0 sgl_done_1_0
create_bd_pin -dir O -from 1 -to 0 sgl_done_3_2
create_bd_pin -dir O -from 1 -to 0 sgl_error_1_0
create_bd_pin -dir O -from 1 -to 0 sgl_error_3_2
create_bd_pin -dir O -from 1 -to 0 sgl_wr_channel
create_bd_pin -dir O -from 127 -to 0 sgl_wr_data
create_bd_pin -dir O sgl_wr_dst_src_n
create_bd_pin -dir I sgl_wr_ready
create_bd_pin -dir O sgl_wr_valid

create_bd_cell -type ip -vlnv xilinx.com:ip:hw_sgl_submit_4ch:1.0 hw_sgl_submit_0
create_bd_cell -type ip -vlnv xilinx.com:ip:xlslice:1.0 sgl_done_1_0
set_property -dict {CONFIG.DIN_FROM 1 CONFIG.DIN_WIDTH 4} [get_bd_cells sgl_done_1_0]
create_bd_cell -type ip -vlnv xilinx.com:ip:xlslice:1.0 sgl_done_3_2
set_property -dict {CONFIG.DIN_TO 2 CONFIG.DIN_FROM 3 CONFIG.DIN_WIDTH 4} [get_bd_cells sgl_done_3_2]
create_bd_cell -type ip -vlnv xilinx.com:ip:xlslice:1.0 sgl_error_1_0
set_property -dict {CONFIG.DIN_FROM 1 CONFIG.DIN_WIDTH 4} [get_bd_cells sgl_error_1_0]
create_bd_cell -type ip -vlnv xilinx.com:ip:xlslice:1.0 sgl_error_3_2
set_property -dict {CONFIG.DIN_TO 2 CONFIG.DIN_FROM 3 CONFIG.DIN_WIDTH 4} [get_bd_cells sgl_error_3_2]
create_bd_cell -type ip -vlnv xilinx.com:ip:xlconcat:2.1 xlconcat_0
set_property -dict {CONFIG.IN0_WIDTH 2 CONFIG.IN1_WIDTH 2} [get_bd_cells xlconcat_0]
create_bd_cell -type ip -vlnv xilinx.com:ip:xlconcat:2.1 xlconcat_1
set_property -dict {CONFIG.IN0_WIDTH 224 CONFIG.IN1_WIDTH 224} [get_bd_cells xlconcat_1]

# ---- hierarchy /reset_top ----
current_bd_instance /reset_top
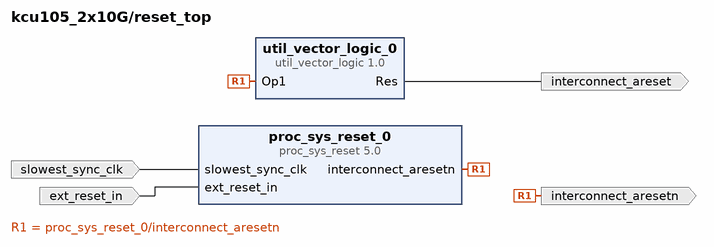
[diagram p12: block diagram inside /reset_top]
create_bd_pin -dir I -type rst ext_reset_in
create_bd_pin -dir O interconnect_areset
create_bd_pin -dir O -type rst interconnect_aresetn
create_bd_pin -dir I -type clk slowest_sync_clk

create_bd_cell -type ip -vlnv xilinx.com:ip:proc_sys_reset:5.0 proc_sys_reset_0
set_property -dict {CONFIG.C_AUX_RESET_HIGH 0} [get_bd_cells proc_sys_reset_0]
create_bd_cell -type ip -vlnv xilinx.com:ip:util_vector_logic:1.0 util_vector_logic_0
set_property -dict {CONFIG.C_SIZE 1 CONFIG.C_OPERATION not} [get_bd_cells util_vector_logic_0]

# ---- connections ----

current_bd_instance /eth_pipe_0
connect_bd_intf_net [get_bd_intf_pins c2s_dre/s_axis] [get_bd_intf_pins mac_phy_ch0/m_axis_rx]
connect_bd_intf_net [get_bd_intf_pins mac_phy_ch0/s_axis_tx] [get_bd_intf_pins s2c_dre/M_AXIS]
connect_bd_intf_net [get_bd_intf_pins c2s_dre_m_axis] [get_bd_intf_pins c2s_dre/M_AXIS]
connect_bd_intf_net [get_bd_intf_pins refclk_diff_port] [get_bd_intf_pins mac_phy_ch0/refclk_diff_port]
connect_bd_intf_net [get_bd_intf_pins s2c_dre_s_axis] [get_bd_intf_pins s2c_dre/S_AXIS]
connect_bd_intf_net [get_bd_intf_pins s_axi] [get_bd_intf_pins mac_phy_ch0/s_axi]
connect_bd_intf_net [get_bd_intf_pins s_axis_pause] [get_bd_intf_pins mac_phy_ch0/s_axis_pause]
connect_bd_net -net M01_ARESETN_1 [get_bd_pins user_resetn] \
  [get_bd_pins c2s_dre/aresetn] [get_bd_pins mac_phy_ch0/rx_axis_aresetn] [get_bd_pins s2c_dre/s_axis_aresetn]
connect_bd_net -net areset_1 [get_bd_pins mac_areset] [get_bd_pins mac_phy_ch0/areset]
connect_bd_net -net logic_high_const [get_bd_pins logic_high/dout] [get_bd_pins c2s_dre/mac_id_valid] [get_bd_pins mac_phy_ch0/rx_dcm_locked]
connect_bd_net -net logic_low_8bit_const [get_bd_pins logic_low_8bit/dout] [get_bd_pins mac_phy_ch0/tx_ifg_delay]
connect_bd_net -net logic_low_const [get_bd_pins logic_low/dout] [get_bd_pins c2s_dre/soft_reset] [get_bd_pins mac_phy_ch0/tx_fault]
connect_bd_net [get_bd_pins mac_id] [get_bd_pins c2s_dre/mac_id]
connect_bd_net [get_bd_pins mac_phy_ch0/areset_clk156_out] [get_bd_pins clk_156_reset] [get_bd_pins c2s_dre/reset] [get_bd_pins reset_156_inv/Op1]
connect_bd_net [get_bd_pins mac_phy_ch0/core_clk156_out] \
  [get_bd_pins clk_156] [get_bd_pins c2s_dre/rx_clk] [get_bd_pins mac_phy_ch0/clk156] [get_bd_pins mac_phy_ch0/s_axi_aclk] \
  [get_bd_pins s2c_dre/m_aclk]
connect_bd_net [get_bd_pins mac_phy_ch0/core_status] [get_bd_pins core_status]
connect_bd_net [get_bd_pins mac_phy_ch0/gtrxreset_out] [get_bd_pins gtrxreset_out]
connect_bd_net [get_bd_pins mac_phy_ch0/gttxreset_out] [get_bd_pins gttxreset_out]
connect_bd_net [get_bd_pins mac_phy_ch0/qpll0lock_out] [get_bd_pins qpll0lock_out]
connect_bd_net [get_bd_pins mac_phy_ch0/qpll0outclk_out] [get_bd_pins qpll0outclk_out]
connect_bd_net [get_bd_pins mac_phy_ch0/qpll0outrefclk_out] [get_bd_pins qpll0outrefclk_out]
connect_bd_net [get_bd_pins mac_phy_ch0/reset_counter_done_out] [get_bd_pins reset_counter_done_out]
connect_bd_net [get_bd_pins mac_phy_ch0/resetdone] [get_bd_pins resetdone]
connect_bd_net [get_bd_pins mac_phy_ch0/rx_statistics_valid] [get_bd_pins c2s_dre/rx_statistics_valid]
connect_bd_net [get_bd_pins mac_phy_ch0/rx_statistics_vector] [get_bd_pins c2s_dre/rx_statistics_vector]
connect_bd_net [get_bd_pins mac_phy_ch0/tx_disable] [get_bd_pins tx_disable]
connect_bd_net [get_bd_pins mac_phy_ch0/txn] [get_bd_pins txn]
connect_bd_net [get_bd_pins mac_phy_ch0/txp] [get_bd_pins txp]
connect_bd_net [get_bd_pins mac_phy_ch0/txuserrdy_out] [get_bd_pins txuserrdy_out]
connect_bd_net [get_bd_pins mac_phy_ch0/txusrclk2_out] [get_bd_pins txusrclk2_out]
connect_bd_net [get_bd_pins mac_phy_ch0/txusrclk_out] [get_bd_pins txusrclk_out]
connect_bd_net -net pcie_dma_wrapper_0_user_clk [get_bd_pins user_clk] [get_bd_pins c2s_dre/aclk] [get_bd_pins s2c_dre/s_axis_aclk]
connect_bd_net [get_bd_pins prtad] [get_bd_pins mac_phy_ch0/prtad]
connect_bd_net [get_bd_pins reset_156_inv/Res] \
  [get_bd_pins clk_156_resetn] [get_bd_pins c2s_dre/s_axis_aresetn] [get_bd_pins mac_phy_ch0/s_axi_aresetn] \
  [get_bd_pins s2c_dre/m_aresetn]
connect_bd_net [get_bd_pins rxn] [get_bd_pins mac_phy_ch0/rxn]
connect_bd_net [get_bd_pins rxp] [get_bd_pins mac_phy_ch0/rxp]
connect_bd_net [get_bd_pins sim_speedup_control] [get_bd_pins mac_phy_ch0/sim_speedup_control]

current_bd_instance /eth_pipe_0/c2s_dre
connect_bd_intf_net [get_bd_intf_pins axis_clock_converter_0/M_AXIS] [get_bd_intf_pins axis_dwidth_converter_0/S_AXIS]
connect_bd_intf_net [get_bd_intf_pins axis_clock_converter_0/S_AXIS] [get_bd_intf_pins rx_interface_0/m_axis]
connect_bd_intf_net [get_bd_intf_pins M_AXIS] [get_bd_intf_pins axis_dwidth_converter_0/M_AXIS]
connect_bd_intf_net [get_bd_intf_pins s_axis] [get_bd_intf_pins rx_interface_0/s_axis]
connect_bd_net -net M01_ARESETN_1 [get_bd_pins aresetn] \
  [get_bd_pins axis_clock_converter_0/m_axis_aresetn] [get_bd_pins axis_dwidth_converter_0/aresetn]
connect_bd_net -net logic_high_const [get_bd_pins mac_id_valid] [get_bd_pins rx_interface_0/mac_id_valid]
connect_bd_net -net logic_low_const [get_bd_pins soft_reset] [get_bd_pins rx_interface_0/promiscuous_mode_en] [get_bd_pins rx_interface_0/soft_reset]
connect_bd_net -net mac_id_cons_const [get_bd_pins mac_id] [get_bd_pins rx_interface_0/mac_id]
connect_bd_net -net mac_phy_ch0_areset_clk156_out [get_bd_pins reset] [get_bd_pins rx_interface_0/reset]
connect_bd_net -net mac_phy_ch0_core_clk156_out [get_bd_pins rx_clk] \
  [get_bd_pins axis_clock_converter_0/s_axis_aclk] [get_bd_pins rx_interface_0/user_clk]
connect_bd_net -net mac_phy_ch0_rx_statistics_valid [get_bd_pins rx_statistics_valid] [get_bd_pins rx_interface_0/rx_statistics_valid]
connect_bd_net -net mac_phy_ch0_rx_statistics_vector [get_bd_pins rx_statistics_vector] [get_bd_pins rx_interface_0/rx_statistics_vector]
connect_bd_net -net pcie_dma_wrapper_0_user_clk [get_bd_pins aclk] \
  [get_bd_pins axis_clock_converter_0/m_axis_aclk] [get_bd_pins axis_dwidth_converter_0/aclk]
connect_bd_net -net reset_156_inv_Res [get_bd_pins s_axis_aresetn] [get_bd_pins axis_clock_converter_0/s_axis_aresetn]

current_bd_instance /eth_pipe_0/mac_phy_ch0
connect_bd_intf_net [get_bd_intf_pins ten_gig_eth_mac_ch0/xgmii_xgmac] [get_bd_intf_pins ten_gig_eth_pcs_pma_ch0/xgmii_interface]
connect_bd_intf_net [get_bd_intf_pins ten_gig_eth_pcs_pma_ch0/core_to_gt_drp] [get_bd_intf_pins ten_gig_eth_pcs_pma_ch0/gt_drp]
connect_bd_intf_net [get_bd_intf_pins m_axis_rx] [get_bd_intf_pins ten_gig_eth_mac_ch0/m_axis_rx]
connect_bd_intf_net [get_bd_intf_pins refclk_diff_port] [get_bd_intf_pins ten_gig_eth_pcs_pma_ch0/refclk_diff_port]
connect_bd_intf_net [get_bd_intf_pins s_axi] [get_bd_intf_pins ten_gig_eth_mac_ch0/s_axi]
connect_bd_intf_net [get_bd_intf_pins s_axis_pause] [get_bd_intf_pins ten_gig_eth_mac_ch0/s_axis_pause]
connect_bd_intf_net [get_bd_intf_pins s_axis_tx] [get_bd_intf_pins ten_gig_eth_mac_ch0/s_axis_tx]
connect_bd_net -net hdp_patgen_0_tx_ifg_delay [get_bd_pins tx_ifg_delay] [get_bd_pins ten_gig_eth_mac_ch0/tx_ifg_delay]
connect_bd_net -net microblaze_0_Clk [get_bd_pins clk156] [get_bd_pins ten_gig_eth_mac_ch0/rx_clk0] [get_bd_pins ten_gig_eth_mac_ch0/tx_clk0]
connect_bd_net [get_bd_pins prtad] [get_bd_pins ten_gig_eth_pcs_pma_ch0/prtad]
connect_bd_net -net reset_mac [get_bd_pins areset] [get_bd_pins ten_gig_eth_mac_ch0/reset] [get_bd_pins ten_gig_eth_pcs_pma_ch0/reset]
connect_bd_net -net reset_n_mac_1 [get_bd_pins rx_axis_aresetn] \
  [get_bd_pins ten_gig_eth_mac_ch0/rx_axis_aresetn] [get_bd_pins ten_gig_eth_mac_ch0/tx_axis_aresetn]
connect_bd_net -net rst_clk_156_156M_peripheral_aresetn [get_bd_pins s_axi_aresetn] [get_bd_pins ten_gig_eth_mac_ch0/s_axi_aresetn]
connect_bd_net [get_bd_pins rxn] [get_bd_pins ten_gig_eth_pcs_pma_ch0/rxn]
connect_bd_net [get_bd_pins rxp] [get_bd_pins ten_gig_eth_pcs_pma_ch0/rxp]
connect_bd_net [get_bd_pins s_axi_aclk] [get_bd_pins ten_gig_eth_mac_ch0/s_axi_aclk]
connect_bd_net -net s_axis_pause_tvalid_1 [get_bd_pins tx_fault] [get_bd_pins ten_gig_eth_pcs_pma_ch0/tx_fault]
connect_bd_net [get_bd_pins sim_speedup_control] [get_bd_pins ten_gig_eth_pcs_pma_ch0/sim_speedup_control]
connect_bd_net [get_bd_pins ten_gig_eth_mac_ch0/mdc] [get_bd_pins ten_gig_eth_pcs_pma_ch0/mdc]
connect_bd_net [get_bd_pins ten_gig_eth_mac_ch0/mdio_out] [get_bd_pins ten_gig_eth_pcs_pma_ch0/mdio_in]
connect_bd_net [get_bd_pins ten_gig_eth_mac_ch0/rx_statistics_valid] [get_bd_pins rx_statistics_valid]
connect_bd_net [get_bd_pins ten_gig_eth_mac_ch0/rx_statistics_vector] [get_bd_pins rx_statistics_vector]
connect_bd_net [get_bd_pins ten_gig_eth_pcs_pma_ch0/areset_clk156_out] [get_bd_pins areset_clk156_out]
connect_bd_net [get_bd_pins ten_gig_eth_pcs_pma_ch0/core_clk156_out] [get_bd_pins core_clk156_out] [get_bd_pins ten_gig_eth_pcs_pma_ch0/dclk]
connect_bd_net [get_bd_pins ten_gig_eth_pcs_pma_ch0/core_status] [get_bd_pins core_status]
connect_bd_net [get_bd_pins ten_gig_eth_pcs_pma_ch0/drp_req] [get_bd_pins ten_gig_eth_pcs_pma_ch0/drp_gnt]
connect_bd_net [get_bd_pins ten_gig_eth_pcs_pma_ch0/gtrxreset_out] [get_bd_pins gtrxreset_out]
connect_bd_net [get_bd_pins ten_gig_eth_pcs_pma_ch0/gttxreset_out] [get_bd_pins gttxreset_out]
connect_bd_net [get_bd_pins ten_gig_eth_pcs_pma_ch0/mdio_out] [get_bd_pins ten_gig_eth_mac_ch0/mdio_in]
connect_bd_net [get_bd_pins ten_gig_eth_pcs_pma_ch0/qpll0lock_out] [get_bd_pins qpll0lock_out]
connect_bd_net [get_bd_pins ten_gig_eth_pcs_pma_ch0/qpll0outclk_out] [get_bd_pins qpll0outclk_out]
connect_bd_net [get_bd_pins ten_gig_eth_pcs_pma_ch0/qpll0outrefclk_out] [get_bd_pins qpll0outrefclk_out]
connect_bd_net [get_bd_pins ten_gig_eth_pcs_pma_ch0/reset_counter_done_out] [get_bd_pins reset_counter_done_out]
connect_bd_net [get_bd_pins ten_gig_eth_pcs_pma_ch0/resetdone] [get_bd_pins resetdone]
connect_bd_net [get_bd_pins ten_gig_eth_pcs_pma_ch0/tx_disable] [get_bd_pins tx_disable]
connect_bd_net [get_bd_pins ten_gig_eth_pcs_pma_ch0/txn] [get_bd_pins txn]
connect_bd_net [get_bd_pins ten_gig_eth_pcs_pma_ch0/txp] [get_bd_pins txp]
connect_bd_net [get_bd_pins ten_gig_eth_pcs_pma_ch0/txuserrdy_out] [get_bd_pins txuserrdy_out]
connect_bd_net [get_bd_pins ten_gig_eth_pcs_pma_ch0/txusrclk2_out] [get_bd_pins txusrclk2_out]
connect_bd_net [get_bd_pins ten_gig_eth_pcs_pma_ch0/txusrclk_out] [get_bd_pins txusrclk_out]
connect_bd_net -net xlconstant_0_const [get_bd_pins rx_dcm_locked] \
  [get_bd_pins ten_gig_eth_mac_ch0/rx_dcm_locked] [get_bd_pins ten_gig_eth_mac_ch0/tx_dcm_locked] \
  [get_bd_pins ten_gig_eth_pcs_pma_ch0/signal_detect]

current_bd_instance /eth_pipe_0/s2c_dre
connect_bd_intf_net [get_bd_intf_pins clk_250_to_156/M_AXIS] [get_bd_intf_pins tx_packet_fifo/S_AXIS]
connect_bd_intf_net [get_bd_intf_pins clk_250_to_156/S_AXIS] [get_bd_intf_pins dwidth_128_to_64bit/M_AXIS]
connect_bd_intf_net [get_bd_intf_pins M_AXIS] [get_bd_intf_pins tx_packet_fifo/M_AXIS]
connect_bd_intf_net [get_bd_intf_pins S_AXIS] [get_bd_intf_pins dwidth_128_to_64bit/S_AXIS]
connect_bd_net -net M01_ARESETN_1 [get_bd_pins s_axis_aresetn] [get_bd_pins clk_250_to_156/s_axis_aresetn] [get_bd_pins dwidth_128_to_64bit/aresetn]
connect_bd_net -net mac_phy_ch0_core_clk156_out [get_bd_pins m_aclk] [get_bd_pins clk_250_to_156/m_axis_aclk] [get_bd_pins tx_packet_fifo/s_aclk]
connect_bd_net -net pcie_dma_wrapper_0_user_clk [get_bd_pins s_axis_aclk] \
  [get_bd_pins clk_250_to_156/s_axis_aclk] [get_bd_pins dwidth_128_to_64bit/aclk]
connect_bd_net -net reset_156_inv_Res [get_bd_pins m_aresetn] [get_bd_pins clk_250_to_156/m_axis_aresetn] [get_bd_pins tx_packet_fifo/s_aresetn]

current_bd_instance /eth_pipe_1
connect_bd_intf_net [get_bd_intf_pins c2s_dre/s_axis] [get_bd_intf_pins mac_phy_ch1/m_axis_rx]
connect_bd_intf_net [get_bd_intf_pins mac_phy_ch1/s_axis_tx] [get_bd_intf_pins s2c_dre/M_AXIS]
connect_bd_intf_net [get_bd_intf_pins c2s_dre_m_axis] [get_bd_intf_pins c2s_dre/M_AXIS]
connect_bd_intf_net [get_bd_intf_pins s2c_dre_s_axis] [get_bd_intf_pins s2c_dre/S_AXIS]
connect_bd_intf_net [get_bd_intf_pins s_axi] [get_bd_intf_pins mac_phy_ch1/s_axi]
connect_bd_intf_net [get_bd_intf_pins s_axis_pause] [get_bd_intf_pins mac_phy_ch1/s_axis_pause]
connect_bd_net -net M01_ARESETN_1 [get_bd_pins user_resetn] \
  [get_bd_pins c2s_dre/aresetn] [get_bd_pins mac_phy_ch1/rx_axis_aresetn] [get_bd_pins s2c_dre/s_axis_aresetn]
connect_bd_net -net areset_1 [get_bd_pins mac_areset] [get_bd_pins mac_phy_ch1/areset]
connect_bd_net [get_bd_pins gtrxreset] [get_bd_pins mac_phy_ch1/gtrxreset]
connect_bd_net [get_bd_pins gttxreset] [get_bd_pins mac_phy_ch1/gttxreset]
connect_bd_net -net logic_high_const [get_bd_pins logic_high/dout] [get_bd_pins c2s_dre/mac_id_valid] [get_bd_pins mac_phy_ch1/rx_dcm_locked]
connect_bd_net -net logic_low_8bit_const [get_bd_pins logic_low_8bit/dout] [get_bd_pins mac_phy_ch1/tx_ifg_delay]
connect_bd_net -net logic_low_const [get_bd_pins logic_low/dout] [get_bd_pins c2s_dre/soft_reset] [get_bd_pins mac_phy_ch1/tx_fault]
connect_bd_net [get_bd_pins mac_id] [get_bd_pins c2s_dre/mac_id]
connect_bd_net -net mac_phy_ch0_areset_clk156_out [get_bd_pins areset_clk156] \
  [get_bd_pins c2s_dre/reset] [get_bd_pins mac_phy_ch1/areset_clk156] [get_bd_pins reset_156_inv/Op1]
connect_bd_net -net mac_phy_ch0_core_clk156_out1 [get_bd_pins clk_156] \
  [get_bd_pins c2s_dre/rx_clk] [get_bd_pins mac_phy_ch1/clk156] [get_bd_pins mac_phy_ch1/s_axi_aclk] \
  [get_bd_pins s2c_dre/m_aclk]
connect_bd_net -net mac_phy_ch0_core_status [get_bd_pins mac_phy_ch1/core_status] [get_bd_pins core_status]
connect_bd_net -net mac_phy_ch0_rx_statistics_valid [get_bd_pins mac_phy_ch1/rx_statistics_valid] [get_bd_pins c2s_dre/rx_statistics_valid]
connect_bd_net -net mac_phy_ch0_rx_statistics_vector [get_bd_pins mac_phy_ch1/rx_statistics_vector] [get_bd_pins c2s_dre/rx_statistics_vector]
connect_bd_net -net mac_phy_ch0_tx_disable [get_bd_pins mac_phy_ch1/tx_disable] [get_bd_pins tx_disable]
connect_bd_net -net mac_phy_ch0_txn [get_bd_pins mac_phy_ch1/txn] [get_bd_pins txn]
connect_bd_net -net mac_phy_ch0_txp [get_bd_pins mac_phy_ch1/txp] [get_bd_pins txp]
connect_bd_net [get_bd_pins mac_phy_ch1/rx_resetdone] [get_bd_pins rx_resetdone]
connect_bd_net [get_bd_pins mac_phy_ch1/tx_resetdone] [get_bd_pins tx_resetdone]
connect_bd_net -net pcie_dma_wrapper_0_user_clk [get_bd_pins user_clk] [get_bd_pins c2s_dre/aclk] [get_bd_pins s2c_dre/s_axis_aclk]
connect_bd_net [get_bd_pins prtad] [get_bd_pins mac_phy_ch1/prtad]
connect_bd_net [get_bd_pins qpll0lock] [get_bd_pins mac_phy_ch1/qpll0lock]
connect_bd_net [get_bd_pins qpll0outclk] [get_bd_pins mac_phy_ch1/qpll0outclk]
connect_bd_net [get_bd_pins qpll0outrefclk] [get_bd_pins mac_phy_ch1/qpll0outrefclk]
connect_bd_net [get_bd_pins reset_156_inv/Res] \
  [get_bd_pins c2s_dre/s_axis_aresetn] [get_bd_pins mac_phy_ch1/s_axi_aresetn] [get_bd_pins s2c_dre/m_aresetn]
connect_bd_net [get_bd_pins reset_counter_done] [get_bd_pins mac_phy_ch1/reset_counter_done]
connect_bd_net [get_bd_pins rxn] [get_bd_pins mac_phy_ch1/rxn]
connect_bd_net [get_bd_pins rxp] [get_bd_pins mac_phy_ch1/rxp]
connect_bd_net [get_bd_pins sim_speedup_control] [get_bd_pins mac_phy_ch1/sim_speedup_control]
connect_bd_net [get_bd_pins txuserrdy] [get_bd_pins mac_phy_ch1/txuserrdy]
connect_bd_net -net txusrclk2_1 [get_bd_pins txusrclk2] [get_bd_pins mac_phy_ch1/txusrclk2]
connect_bd_net [get_bd_pins txusrclk] [get_bd_pins mac_phy_ch1/txusrclk]

current_bd_instance /eth_pipe_1/c2s_dre
connect_bd_intf_net [get_bd_intf_pins axis_clock_converter_0/M_AXIS] [get_bd_intf_pins axis_dwidth_converter_0/S_AXIS]
connect_bd_intf_net [get_bd_intf_pins axis_clock_converter_0/S_AXIS] [get_bd_intf_pins rx_interface_0/m_axis]
connect_bd_intf_net [get_bd_intf_pins M_AXIS] [get_bd_intf_pins axis_dwidth_converter_0/M_AXIS]
connect_bd_intf_net [get_bd_intf_pins s_axis] [get_bd_intf_pins rx_interface_0/s_axis]
connect_bd_net -net M01_ARESETN_1 [get_bd_pins aresetn] \
  [get_bd_pins axis_clock_converter_0/m_axis_aresetn] [get_bd_pins axis_dwidth_converter_0/aresetn]
connect_bd_net -net logic_high_const [get_bd_pins mac_id_valid] [get_bd_pins rx_interface_0/mac_id_valid]
connect_bd_net -net logic_low_const [get_bd_pins soft_reset] [get_bd_pins rx_interface_0/promiscuous_mode_en] [get_bd_pins rx_interface_0/soft_reset]
connect_bd_net -net mac_id_cons_const [get_bd_pins mac_id] [get_bd_pins rx_interface_0/mac_id]
connect_bd_net -net mac_phy_ch0_areset_clk156_out [get_bd_pins reset] [get_bd_pins rx_interface_0/reset]
connect_bd_net -net mac_phy_ch0_core_clk156_out [get_bd_pins rx_clk] \
  [get_bd_pins axis_clock_converter_0/s_axis_aclk] [get_bd_pins rx_interface_0/user_clk]
connect_bd_net -net mac_phy_ch0_rx_statistics_valid [get_bd_pins rx_statistics_valid] [get_bd_pins rx_interface_0/rx_statistics_valid]
connect_bd_net -net mac_phy_ch0_rx_statistics_vector [get_bd_pins rx_statistics_vector] [get_bd_pins rx_interface_0/rx_statistics_vector]
connect_bd_net -net pcie_dma_wrapper_0_user_clk [get_bd_pins aclk] \
  [get_bd_pins axis_clock_converter_0/m_axis_aclk] [get_bd_pins axis_dwidth_converter_0/aclk]
connect_bd_net -net reset_156_inv_Res [get_bd_pins s_axis_aresetn] [get_bd_pins axis_clock_converter_0/s_axis_aresetn]

current_bd_instance /eth_pipe_1/mac_phy_ch1
connect_bd_intf_net [get_bd_intf_pins ten_gig_eth_mac_ch1/xgmii_xgmac] [get_bd_intf_pins ten_gig_eth_pcs_pma_ch1/xgmii_interface]
connect_bd_intf_net [get_bd_intf_pins ten_gig_eth_pcs_pma_ch1/core_to_gt_drp] [get_bd_intf_pins ten_gig_eth_pcs_pma_ch1/gt_drp]
connect_bd_intf_net [get_bd_intf_pins m_axis_rx] [get_bd_intf_pins ten_gig_eth_mac_ch1/m_axis_rx]
connect_bd_intf_net [get_bd_intf_pins s_axi] [get_bd_intf_pins ten_gig_eth_mac_ch1/s_axi]
connect_bd_intf_net [get_bd_intf_pins s_axis_pause] [get_bd_intf_pins ten_gig_eth_mac_ch1/s_axis_pause]
connect_bd_intf_net [get_bd_intf_pins s_axis_tx] [get_bd_intf_pins ten_gig_eth_mac_ch1/s_axis_tx]
connect_bd_net -net areset_clk156_1 [get_bd_pins areset_clk156] [get_bd_pins ten_gig_eth_pcs_pma_ch1/areset_clk156]
connect_bd_net [get_bd_pins gtrxreset] [get_bd_pins ten_gig_eth_pcs_pma_ch1/gtrxreset]
connect_bd_net [get_bd_pins gttxreset] [get_bd_pins ten_gig_eth_pcs_pma_ch1/gttxreset]
connect_bd_net -net hdp_patgen_0_tx_ifg_delay [get_bd_pins tx_ifg_delay] [get_bd_pins ten_gig_eth_mac_ch1/tx_ifg_delay]
connect_bd_net -net microblaze_0_Clk [get_bd_pins clk156] \
  [get_bd_pins ten_gig_eth_mac_ch1/rx_clk0] [get_bd_pins ten_gig_eth_mac_ch1/tx_clk0] \
  [get_bd_pins ten_gig_eth_pcs_pma_ch1/clk156] [get_bd_pins ten_gig_eth_pcs_pma_ch1/dclk]
connect_bd_net [get_bd_pins prtad] [get_bd_pins ten_gig_eth_pcs_pma_ch1/prtad]
connect_bd_net [get_bd_pins qpll0lock] [get_bd_pins ten_gig_eth_pcs_pma_ch1/qpll0lock]
connect_bd_net [get_bd_pins qpll0outclk] [get_bd_pins ten_gig_eth_pcs_pma_ch1/qpll0outclk]
connect_bd_net [get_bd_pins qpll0outrefclk] [get_bd_pins ten_gig_eth_pcs_pma_ch1/qpll0outrefclk]
connect_bd_net [get_bd_pins reset_counter_done] [get_bd_pins ten_gig_eth_pcs_pma_ch1/reset_counter_done]
connect_bd_net -net reset_mac [get_bd_pins areset] [get_bd_pins ten_gig_eth_mac_ch1/reset] [get_bd_pins ten_gig_eth_pcs_pma_ch1/areset]
connect_bd_net -net reset_n_mac_1 [get_bd_pins rx_axis_aresetn] \
  [get_bd_pins ten_gig_eth_mac_ch1/rx_axis_aresetn] [get_bd_pins ten_gig_eth_mac_ch1/tx_axis_aresetn]
connect_bd_net -net rst_clk_156_156M_peripheral_aresetn [get_bd_pins s_axi_aresetn] [get_bd_pins ten_gig_eth_mac_ch1/s_axi_aresetn]
connect_bd_net [get_bd_pins rxn] [get_bd_pins ten_gig_eth_pcs_pma_ch1/rxn]
connect_bd_net [get_bd_pins rxp] [get_bd_pins ten_gig_eth_pcs_pma_ch1/rxp]
connect_bd_net [get_bd_pins s_axi_aclk] [get_bd_pins ten_gig_eth_mac_ch1/s_axi_aclk]
connect_bd_net -net s_axis_pause_tvalid_1 [get_bd_pins tx_fault] [get_bd_pins ten_gig_eth_pcs_pma_ch1/tx_fault]
connect_bd_net [get_bd_pins sim_speedup_control] [get_bd_pins ten_gig_eth_pcs_pma_ch1/sim_speedup_control]
connect_bd_net -net ten_gig_eth_mac_ch0_mdc [get_bd_pins ten_gig_eth_mac_ch1/mdc] [get_bd_pins ten_gig_eth_pcs_pma_ch1/mdc]
connect_bd_net -net ten_gig_eth_mac_ch0_mdio_out [get_bd_pins ten_gig_eth_mac_ch1/mdio_out] [get_bd_pins ten_gig_eth_pcs_pma_ch1/mdio_in]
connect_bd_net [get_bd_pins ten_gig_eth_mac_ch1/rx_statistics_valid] [get_bd_pins rx_statistics_valid]
connect_bd_net [get_bd_pins ten_gig_eth_mac_ch1/rx_statistics_vector] [get_bd_pins rx_statistics_vector]
connect_bd_net -net ten_gig_eth_pcs_pma_ch0_core_status [get_bd_pins ten_gig_eth_pcs_pma_ch1/core_status] [get_bd_pins core_status]
connect_bd_net -net ten_gig_eth_pcs_pma_ch0_drp_req [get_bd_pins ten_gig_eth_pcs_pma_ch1/drp_req] [get_bd_pins ten_gig_eth_pcs_pma_ch1/drp_gnt]
connect_bd_net -net ten_gig_eth_pcs_pma_ch0_mdio_out [get_bd_pins ten_gig_eth_pcs_pma_ch1/mdio_out] [get_bd_pins ten_gig_eth_mac_ch1/mdio_in]
connect_bd_net -net ten_gig_eth_pcs_pma_ch0_tx_disable [get_bd_pins ten_gig_eth_pcs_pma_ch1/tx_disable] [get_bd_pins tx_disable]
connect_bd_net -net ten_gig_eth_pcs_pma_ch0_txn [get_bd_pins ten_gig_eth_pcs_pma_ch1/txn] [get_bd_pins txn]
connect_bd_net -net ten_gig_eth_pcs_pma_ch0_txp [get_bd_pins ten_gig_eth_pcs_pma_ch1/txp] [get_bd_pins txp]
connect_bd_net [get_bd_pins ten_gig_eth_pcs_pma_ch1/rx_resetdone] [get_bd_pins rx_resetdone]
connect_bd_net [get_bd_pins ten_gig_eth_pcs_pma_ch1/tx_resetdone] [get_bd_pins tx_resetdone]
connect_bd_net [get_bd_pins ten_gig_eth_pcs_pma_ch1/txclk322] [get_bd_pins txclk322]
connect_bd_net [get_bd_pins txuserrdy] [get_bd_pins ten_gig_eth_pcs_pma_ch1/txuserrdy]
connect_bd_net -net txusrclk2_1 [get_bd_pins txusrclk2] [get_bd_pins ten_gig_eth_pcs_pma_ch1/txusrclk2]
connect_bd_net [get_bd_pins txusrclk] [get_bd_pins ten_gig_eth_pcs_pma_ch1/txusrclk]
connect_bd_net -net xlconstant_0_const [get_bd_pins rx_dcm_locked] \
  [get_bd_pins ten_gig_eth_mac_ch1/rx_dcm_locked] [get_bd_pins ten_gig_eth_mac_ch1/tx_dcm_locked] \
  [get_bd_pins ten_gig_eth_pcs_pma_ch1/signal_detect]
connect_bd_net [get_bd_pins xlconstant_high_2_0/dout] [get_bd_pins ten_gig_eth_pcs_pma_ch1/pma_pmd_type]
